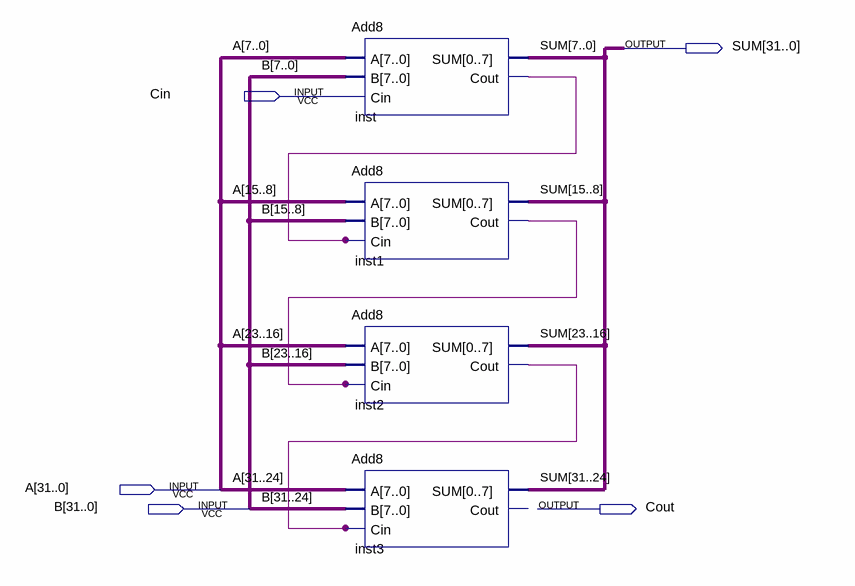
[diagram p0: schematic sheet]
// Quartus schematic Add32.bdf as structural Verilog: 4 symbols, 5 pins
module Add32 (
  input  Cin,
  input  [31:0] A,
  input  [31:0] B,
  output [31:0] SUM,
  output Cout
);

  wire inst1_cout, inst2_cout, inst_cout;

  Add8 inst (.A(A[7:0]), .B(B[7:0]), .Cin(Cin), .SUM(SUM[7:0]), .Cout(inst_cout));
  Add8 inst1 (.A(A[15:8]), .B(B[15:8]), .Cin(inst_cout), .SUM(SUM[15:8]), .Cout(inst1_cout));
  Add8 inst2 (.A(A[23:16]), .B(B[23:16]), .Cin(inst1_cout), .SUM(SUM[23:16]), .Cout(inst2_cout));
  Add8 inst3 (.A(A[31:24]), .B(B[31:24]), .Cin(inst2_cout), .SUM(SUM[31:24]));  // open: Cout
endmodule
